# Altium project PSoC Devboard CAN Cape.PrjPcb
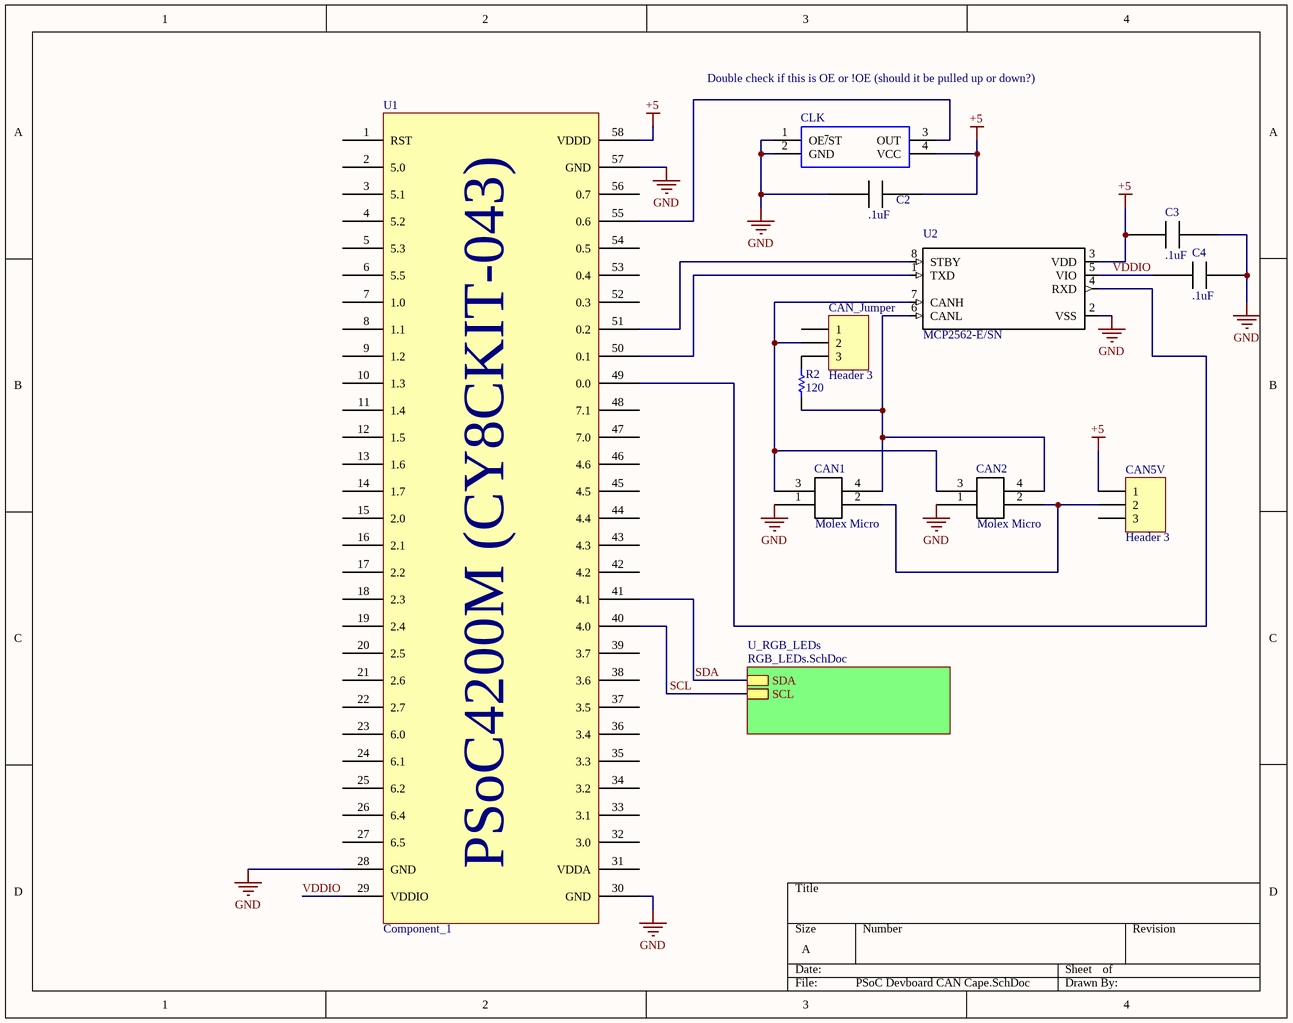
[diagram p0: PSoC Devboard CAN Cape.SchDoc]
2 sheets, 15 parts. Net scope: hierarchical (ports join the sheet entries above them; power ports are global).
Board file: PSoC Devboard CAN Cape.PcbDoc
Sheets:
  PSoC Devboard CAN Cape.SchDoc
    U_RGB_LEDs = RGB_LEDs.SchDoc

## Sheet PSoC Devboard CAN Cape.SchDoc
size A

### Parts
C2  .1uF  [0805]
C3  .1uF  [0805]
C4  .1uF  [0805]
CAN1  Molex Micro  [0430450427]
CAN2  Molex Micro  [0430450427]
CAN5V  Header 3  [HDR1X3]
CAN_Jumper  Header 3  [HDR1X3]
CLK  SG-636PCW_50.0000MC3__ROHS  [SG-636]  (value not drawn)
R2  120  [RESC0805(2012)_N]
U1  Component_1  [CY8CKIT-043]
U2  MCP2562-E/SN  [SOIC127P600X175-8N]

### Sub-sheets
U_RGB_LEDs = RGB_LEDs.SchDoc: SDA, SCL

### Nets
+5: C2.2 C3.1 CAN5V.1 CLK.4(VCC) U1.58(VDDD) U2.3(VDD)
GND: C2.1 C3.2 C4.2 CAN1.1 CAN2.1 CLK.1(OE~{/}ST) CLK.2(GND) U1.28(GND) U1.30(GND) U1.57(GND) U2.2(VSS)
SCL: U1.40(4.0) ; sheet U_RGB_LEDs/SCL
SDA: U1.41(4.1) ; sheet U_RGB_LEDs/SDA
VDDIO: C4.1 U1.29(VDDIO) U2.5(VIO)
NetCAN1_2: CAN1.2 CAN2.2 CAN5V.2
NetCAN1_3: CAN1.3 CAN2.3 CAN_Jumper.2 U2.7(CANH)
NetCAN1_4: CAN1.4 CAN2.4 R2.1 U2.6(CANL)
NetCAN_Jumper_3: CAN_Jumper.3 R2.2
NetCLK_3: CLK.3(OUT) U1.55(0.6)
NetU1_49: U1.49(0.0) U2.4(RXD)
NetU1_50: U1.50(0.1) U2.1(TXD)
NetU1_51: U1.51(0.2) U2.8(STBY)

Not connected (* = marked no-connect by the designer): CAN5V 3; CAN_Jumper 1; U1 1(RST) 2(5.0) 3(5.1) 4(5.2) 5(5.3) 6(5.5) 7(1.0) 8(1.1) 9(1.2) 10(1.3) 11(1.4) 12(1.5) 13(1.6) 14(1.7) 15(2.0) 16(2.1) 17(2.2) 18(2.3) 19(2.4) 20(2.5) 21(2.6) 22(2.7) 23(6.0) 24(6.1) 25(6.2) 26(6.4) 27(6.5) 31(VDDA) 32(3.0) 33(3.1) 34(3.2) 35(3.3) 36(3.4) 37(3.5) 38(3.6) 39(3.7) 42(4.2) 43(4.3) 44(4.4) 45(4.5) 46(4.6) 47(7.0) 48(7.1) 52(0.3) 53(0.4) 54(0.5) 56(0.7)

### Notes on the sheet
- Double check if this is OE or !OE (should it be pulled up or down?)
- (in symbol Component_1) PSoC4200M (CY8CKIT-043)

### Library data of the parts
C2-C4 = Cap
CAN1 CAN2 = Molex micro-fit 4-pin (dual row schematic): Molex micro-fit 3.0, P/N 0430450427
CAN5V CAN_Jumper = Header 3: Header, 3-Pin; LatestRevisionDate: 17-Jul-2002; LatestRevisionNote: Re-released for DXP Platform.; Publisher: Altium Limited
CLK = SG-636: Standard Clock Oscillators 50MHz 3.3Volt 100ppm -20C +70C; Manufacturer_Name: Epson Timing; Manufacturer_Part_Number: SG-636PCW 50.0000MC3: ROHS; RS Part Number: *; RS Price/Stock: *; Arrow Part Number: SG-636PCW 50.0000MC3: ROHS; Arrow Price/Stock: *; Datasheet Link: http://www.mouser.com/ds/2/137/G-636PCE_en-1003252.pdf
R2 = 120R 5% 0805: 120R 0.125W 5% 0805 (2012 Metric)  SMD; Case-Metric: 2012; Value: 120.00 Ohm; Case-EIA: 0805; Tolerance: 5 %; Technology: SMT; Power: 0.125 W
U2 = MCP2562-E/SN: Microchip MCP2562-E/SN, CAN Transceiver 1MBps 1-channel IEC 61000-4-2, 8-Pin SOIC; Price: None; MF: Microchip; SnapEDA_Link: https://www.snapeda.com/parts/MCP2562-E/SN/Microchip/view-part/?ref=snap; MP: MCP2562-E/SN; Availability: Unavailable; Package: SO-8 Microchip; Value: *

## Sheet RGB_LEDs.SchDoc
size A
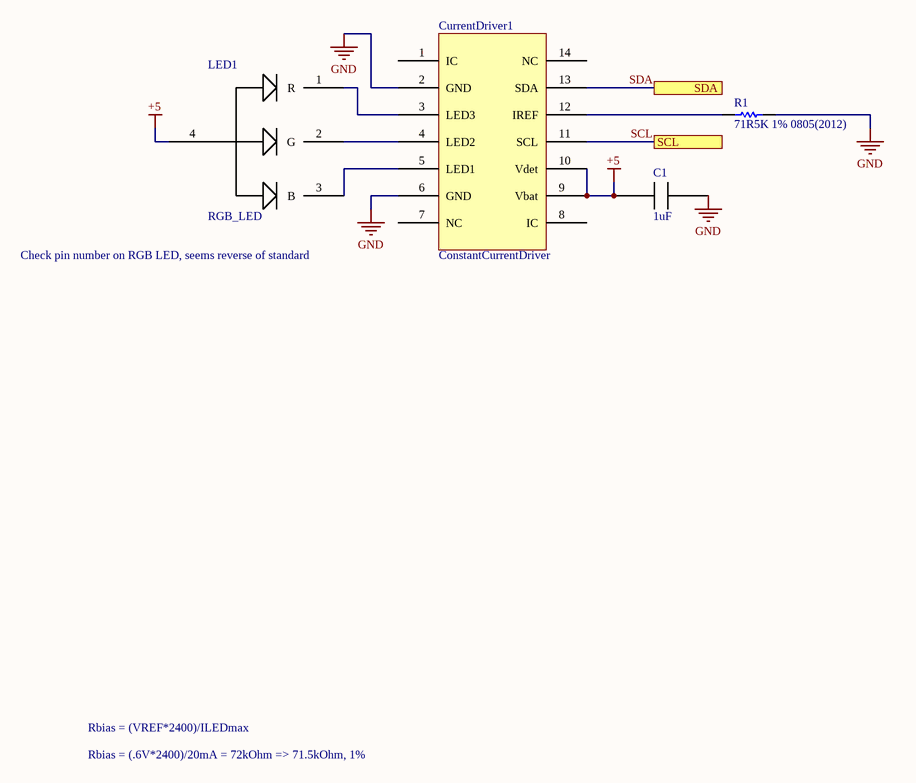
[diagram p1: RGB_LEDs.SchDoc]

### Parts
C1  1uF  [0805]
CurrentDriver1  ConstantCurrentDriver  [NCP5623]
LED1  RGB_LED  [ASMB-MTB1-0A3A2]
R1  71R5K 1% 0805(2012)  [RESC0805(2012)_N]

### Ports
SCL, SDA

### Nets
+5: C1.1 CurrentDriver1.9(Vbat) CurrentDriver1.10(Vdet) LED1.4
GND: C1.2 CurrentDriver1.2(GND) CurrentDriver1.6(GND) R1.2
SCL: CurrentDriver1.11(SCL) ; port SCL
SDA: CurrentDriver1.13(SDA) ; port SDA
NetCurrentDriver1_3: CurrentDriver1.3(LED3) LED1.1(R)
NetCurrentDriver1_4: CurrentDriver1.4(LED2) LED1.2(G)
NetCurrentDriver1_5: CurrentDriver1.5(LED1) LED1.3(B)
NetCurrentDriver1_12: CurrentDriver1.12(IREF) R1.1

Not connected (* = marked no-connect by the designer): CurrentDriver1 1(IC) 7(NC) 8(IC) 14(NC)

### Notes on the sheet
- Check pin number on RGB LED, seems reverse of standard
- Rbias = (VREF*2400)/ILEDmax
- Rbias = (.6V*2400)/20mA = 72kOhm => 71.5kOhm, 1%

### Library data of the parts
C1 = Cap
R1 = 120R 5% 0805: as R2 on sheet PSoC Devboard CAN Cape; Tolerance: 5 %; Technology: SMT; Power: 0.125 W

## Nets that join several sheets
+5: PSoC Devboard CAN Cape (6 pins), RGB_LEDs (C1.1 CurrentDriver1.9 CurrentDriver1.10 LED1.4)
GND: PSoC Devboard CAN Cape (11 pins), RGB_LEDs (C1.2 CurrentDriver1.2 CurrentDriver1.6 R1.2)
SCL: PSoC Devboard CAN Cape (U1.40), RGB_LEDs (CurrentDriver1.11)
SDA: PSoC Devboard CAN Cape (U1.41), RGB_LEDs (CurrentDriver1.13)